# Altium schematic sheet POWER TREE.SchDoc
size 800 x 566 mm; SheetNumber: 2; SheetTotal: 3; ENG_APP_DATE: --/--/--; DSN_APP_DATE: --/--/--; CHK_APP_DATE: --/--/--; Version: 1
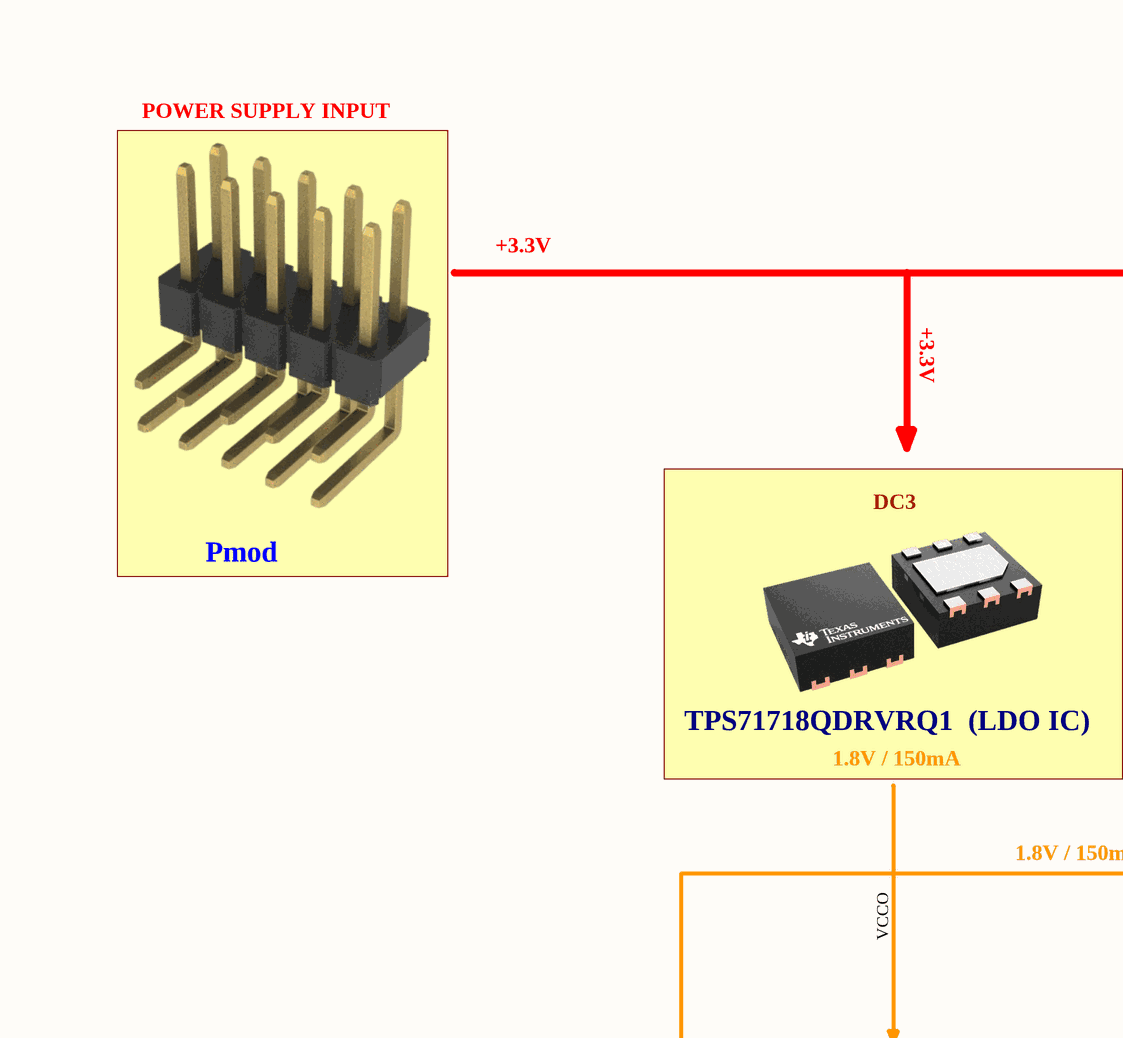
[diagram p0: POWER TREE.SchDoc, top left]
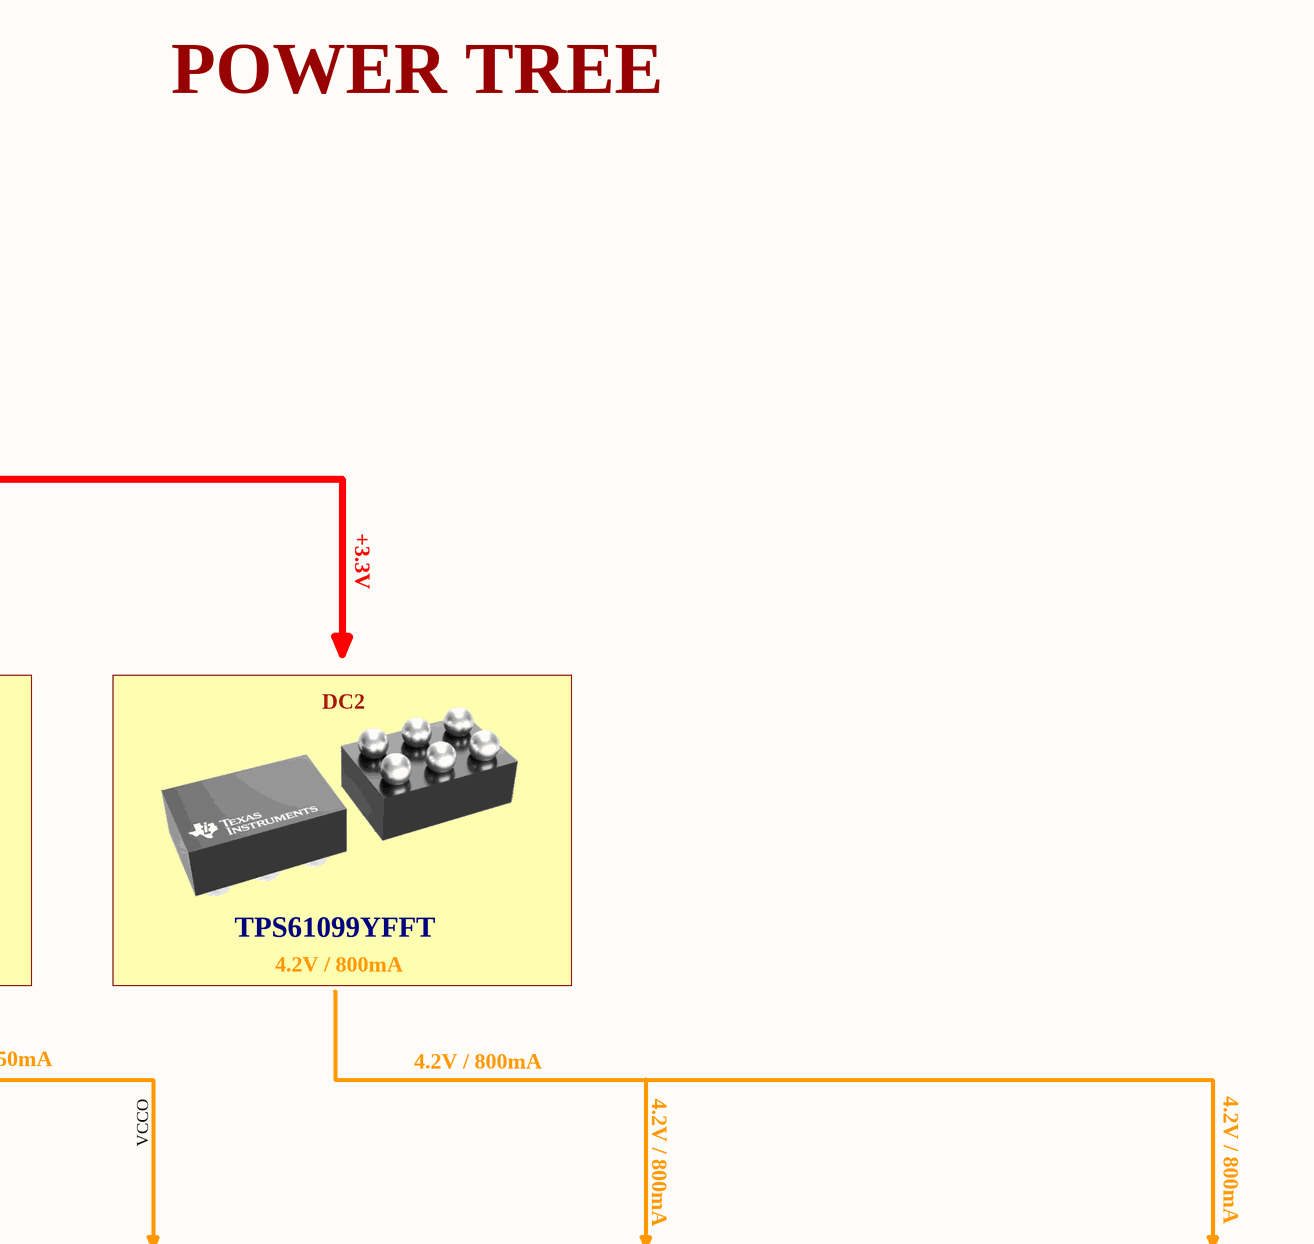
[diagram p1: POWER TREE.SchDoc, top right]
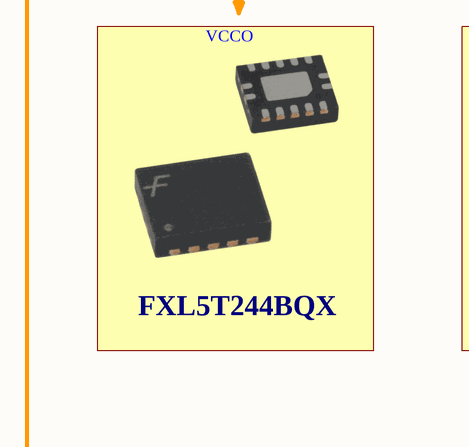
[diagram p2: POWER TREE.SchDoc, bottom left]
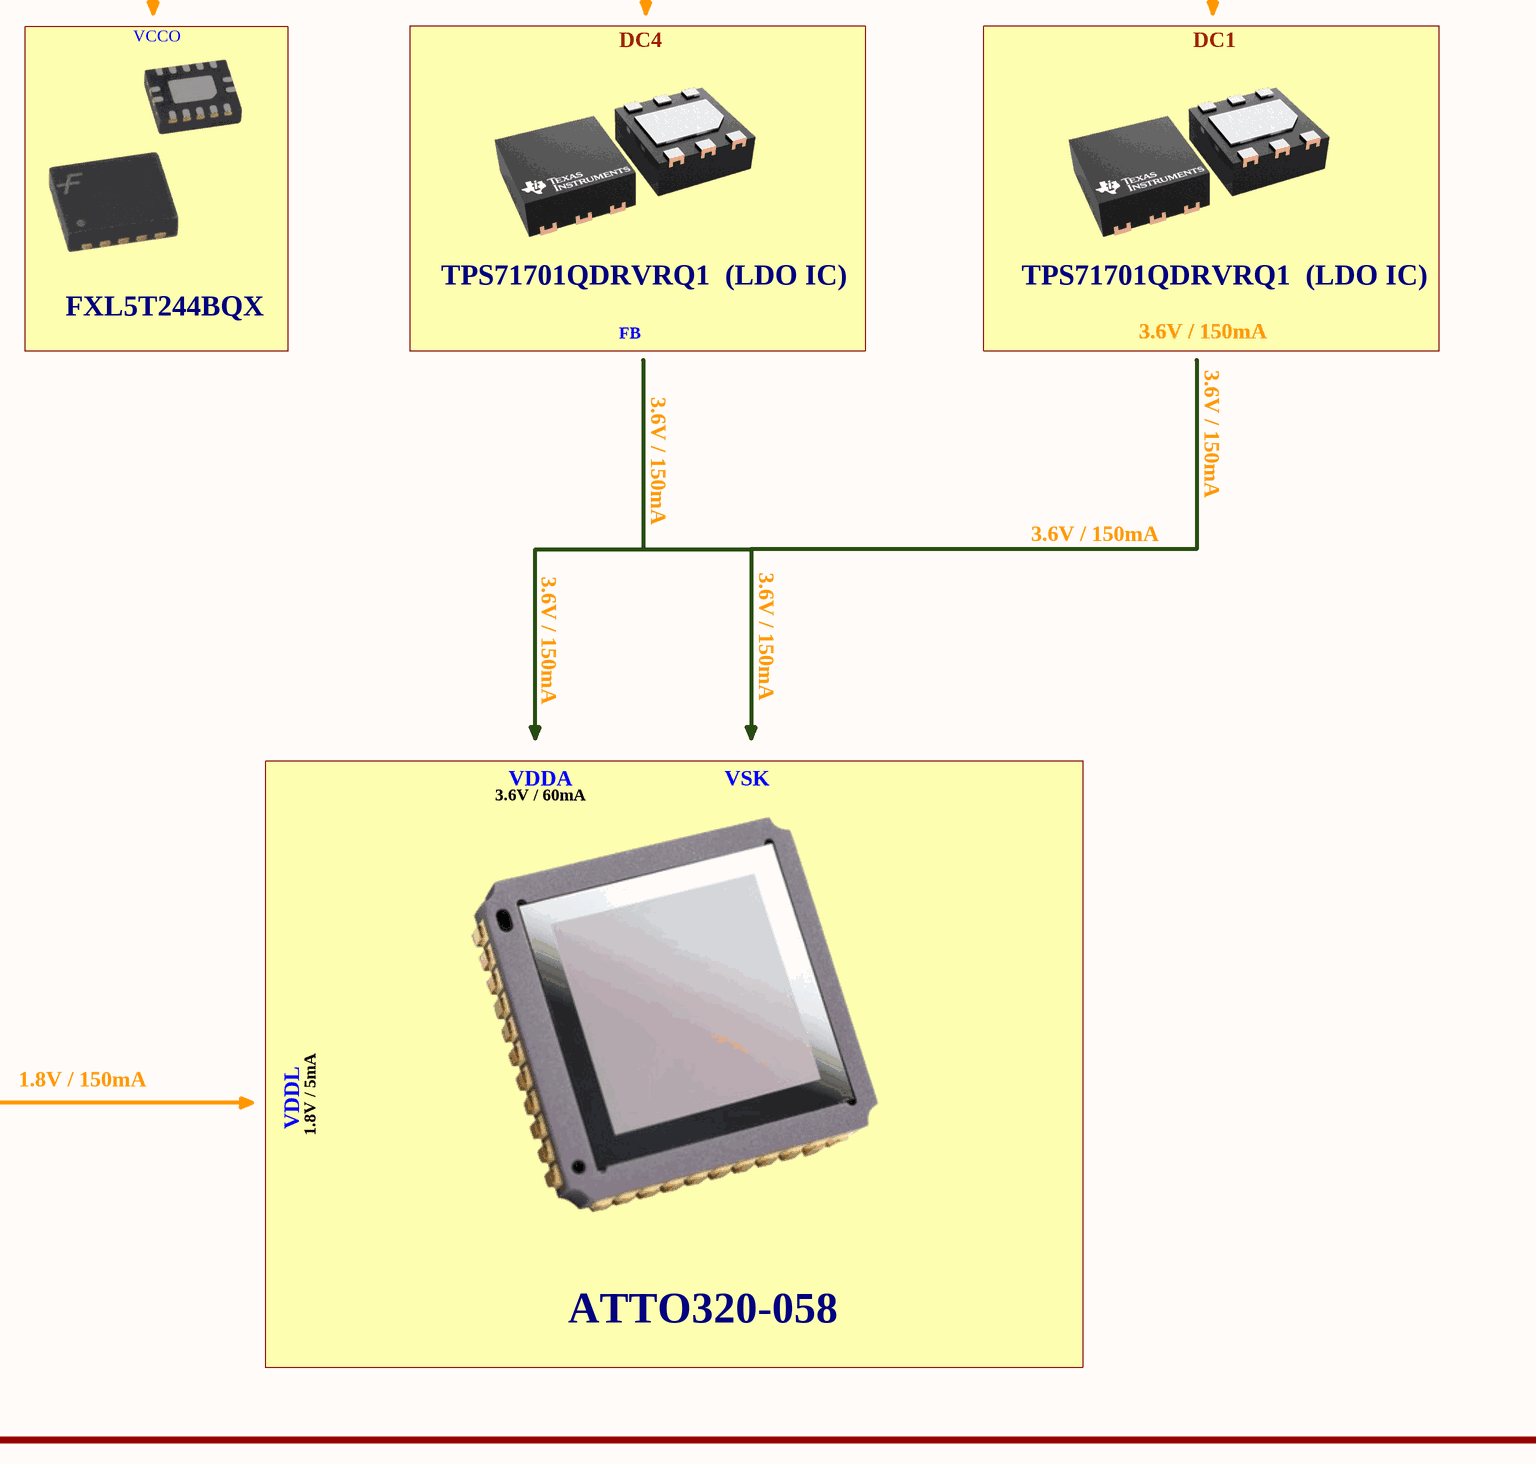
[diagram p3: POWER TREE.SchDoc, bottom right]

## Notes on the sheet
- POWER TREE
- POWER SUPPLY INPUT
- +3.3V
- DC3
- DC2
- Pmod
- TPS71718QDRVRQ1  (LDO IC)
- TPS61099YFFT
- 1.8V / 150mA
- 4.2V / 800mA
- VCCO
- DC4
- DC1
- FXL5T244BQX
- TPS71701QDRVRQ1  (LDO IC)
- FB
- 3.6V / 150mA
- VDDA
- VSK
- 3.6V / 60mA
- VDDL
- 1.8V / 5mA
- ATTO320-058
- TITLE :-
- VERSION :-
- PROJECT :-
- SHEET :-
- REVISION:-
- OF
- CONFIDENTIAL
- DATE :-